# Altium schematic sheet HDMI.SchDoc
size A4; SheetNumber: 1; SheetTotal: 4
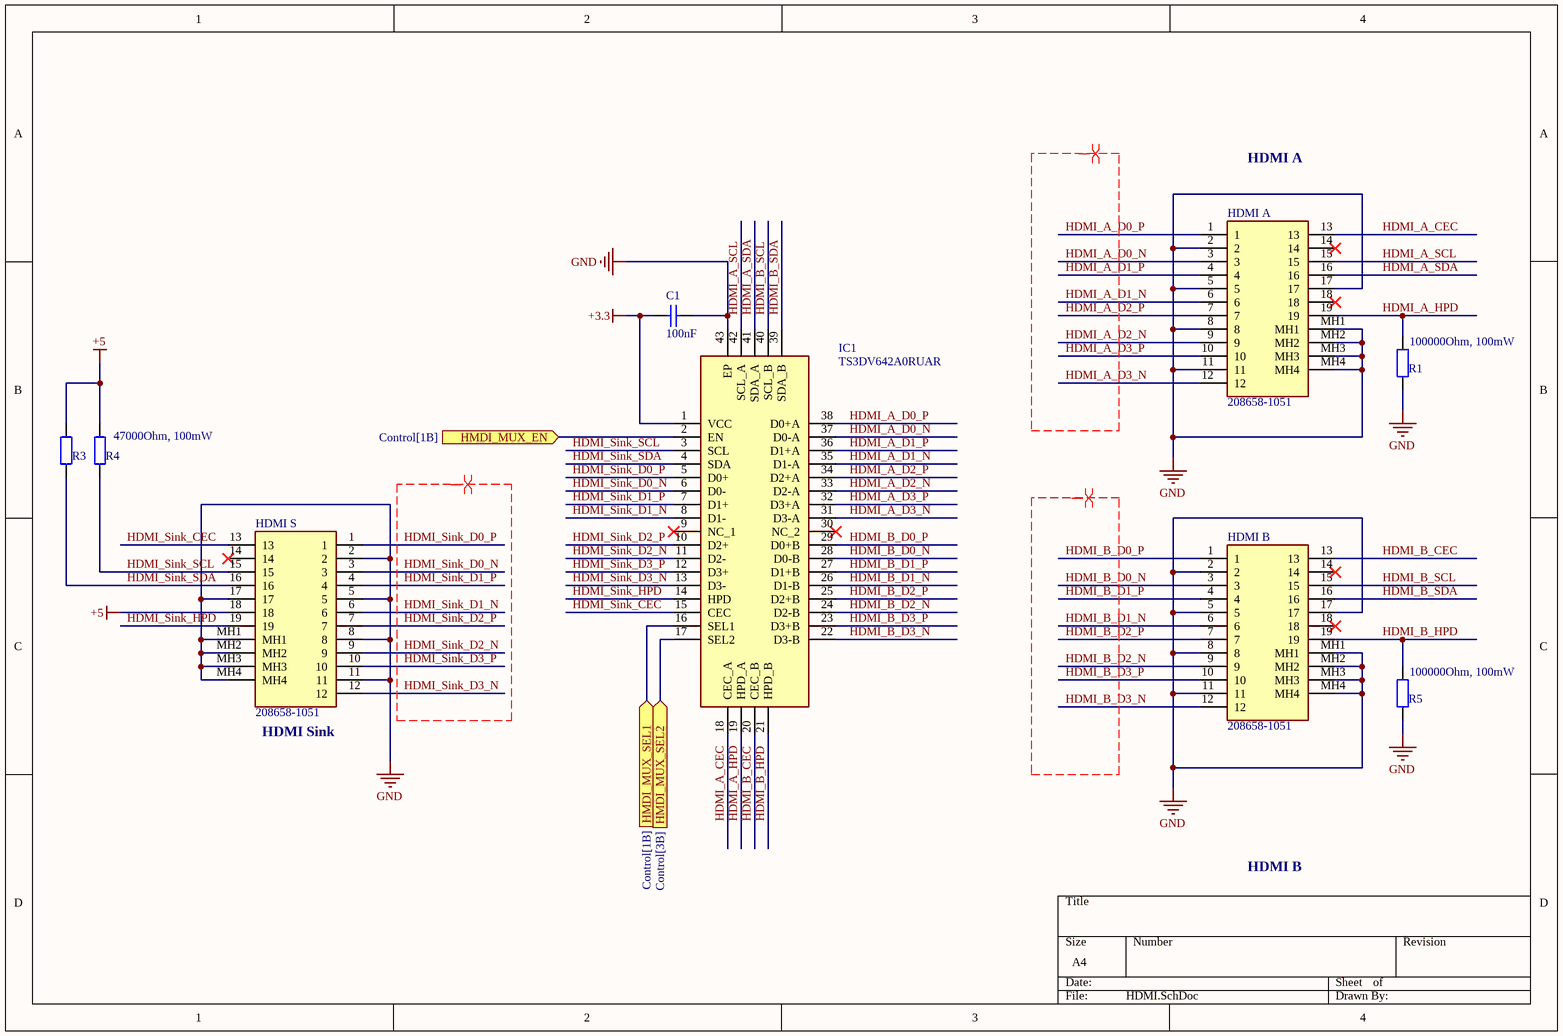
[diagram p0: HDMI.SchDoc]

## Parts
C1  Capacitance: 100nF  [WCAP-CSGP_0402_L1W0.5H0.5]  (hidden comment: 885012205037)
HDMI_A  208658-1051  [2086581051]
HDMI_B  208658-1051  [2086581051]
HDMI_S  208658-1051  [2086581051]
IC1  TS3DV642A0RUAR  [QFN50P350X900X80-43N-D]
R1  100000Ohm, 100mW  [WRIS-RSKS_0402]
R3  47000Ohm, 100mW  [WRIS-RSKS_0402]  (value not drawn)
R4  47000Ohm, 100mW  [WRIS-RSKS_0402]
R5  100000Ohm, 100mW  [WRIS-RSKS_0402]

## Ports
HMDI_MUX_EN (in, see Control[1B]), HMDI_MUX_SEL1 (in, see Control[1B]), HMDI_MUX_SEL2 (in, see Control[3B])

## Nets
+3.3: C1.1 IC1.1(VCC)
+5: HDMI_S.18 R3.2 R4.2
GND: C1.2 HDMI_A.2 HDMI_A.5 HDMI_A.8 HDMI_A.11 HDMI_A.17 HDMI_A.MH1 HDMI_A.MH2 HDMI_A.MH3 HDMI_A.MH4 HDMI_B.2 HDMI_B.5 HDMI_B.8 HDMI_B.11 HDMI_B.17 HDMI_B.MH1 HDMI_B.MH2 HDMI_B.MH3 HDMI_B.MH4 HDMI_S.2 HDMI_S.5 HDMI_S.8 HDMI_S.11 HDMI_S.17 HDMI_S.MH1 HDMI_S.MH2 HDMI_S.MH3 HDMI_S.MH4 IC1.43(EP) R1.1 R5.1
HDMI_A_CEC: HDMI_A.13 IC1.18(CEC_A)
HDMI_A_D0_N: HDMI_A.3 IC1.37(D0-A)
HDMI_A_D0_P: HDMI_A.1 IC1.38(D0+A)
HDMI_A_D1_N: HDMI_A.6 IC1.35(D1-A)
HDMI_A_D1_P: HDMI_A.4 IC1.36(D1+A)
HDMI_A_D2_N: HDMI_A.9 IC1.33(D2-A)
HDMI_A_D2_P: HDMI_A.7 IC1.34(D2+A)
HDMI_A_D3_N: HDMI_A.12 IC1.31(D3-A)
HDMI_A_D3_P: HDMI_A.10 IC1.32(D3+A)
HDMI_A_HPD: HDMI_A.19 IC1.19(HPD_A) R1.2
HDMI_A_SCL: HDMI_A.15 IC1.42(SCL_A)
HDMI_A_SDA: HDMI_A.16 IC1.41(SDA_A)
HDMI_B_CEC: HDMI_B.13 IC1.20(CEC_B)
HDMI_B_D0_N: HDMI_B.3 IC1.28(D0-B)
HDMI_B_D0_P: HDMI_B.1 IC1.29(D0+B)
HDMI_B_D1_N: HDMI_B.6 IC1.26(D1-B)
HDMI_B_D1_P: HDMI_B.4 IC1.27(D1+B)
HDMI_B_D2_N: HDMI_B.9 IC1.24(D2-B)
HDMI_B_D2_P: HDMI_B.7 IC1.25(D2+B)
HDMI_B_D3_N: HDMI_B.12 IC1.22(D3-B)
HDMI_B_D3_P: HDMI_B.10 IC1.23(D3+B)
HDMI_B_HPD: HDMI_B.19 IC1.21(HPD_B) R5.2
HDMI_B_SCL: HDMI_B.15 IC1.40(SCL_B)
HDMI_B_SDA: HDMI_B.16 IC1.39(SDA_B)
HDMI_Sink_CEC: HDMI_S.13 IC1.15(CEC)
HDMI_Sink_D0_N: HDMI_S.3 IC1.6(D0-)
HDMI_Sink_D0_P: HDMI_S.1 IC1.5(D0+)
HDMI_Sink_D1_N: HDMI_S.6 IC1.8(D1-)
HDMI_Sink_D1_P: HDMI_S.4 IC1.7(D1+)
HDMI_Sink_D2_N: HDMI_S.9 IC1.11(D2-)
HDMI_Sink_D2_P: HDMI_S.7 IC1.10(D2+)
HDMI_Sink_D3_N: HDMI_S.12 IC1.13(D3-)
HDMI_Sink_D3_P: HDMI_S.10 IC1.12(D3+)
HDMI_Sink_HPD: HDMI_S.19 IC1.14(HPD)
HDMI_Sink_SCL: HDMI_S.15 IC1.3(SCL) R4.1
HDMI_Sink_SDA: HDMI_S.16 IC1.4(SDA) R3.1
HMDI_MUX_EN: IC1.2(EN) ; port HMDI_MUX_EN
HMDI_MUX_SEL1: IC1.16(SEL1) ; port HMDI_MUX_SEL1
HMDI_MUX_SEL2: IC1.17(SEL2) ; port HMDI_MUX_SEL2

Not connected (* = marked no-connect by the designer): HDMI_A 14* 18*; HDMI_B 14* 18*; HDMI_S 14*; IC1 9(NC_1)* 30(NC_2)*

## Layout directives
differential pair; differential pair class Z100: HDMI_A_D0_N, HDMI_A_D0_P, HDMI_A_D1_N, HDMI_A_D1_P, HDMI_A_D2_N, HDMI_A_D2_P, HDMI_A_D3_N, HDMI_A_D3_P, HDMI_B_D0_N, HDMI_B_D0_P, HDMI_B_D1_N, HDMI_B_D1_P, HDMI_B_D2_N, HDMI_B_D2_P, HDMI_B_D3_N, HDMI_B_D3_P, HDMI_Sink_D0_N, HDMI_Sink_D0_P, HDMI_Sink_D1_N, HDMI_Sink_D1_P, HDMI_Sink_D2_N, HDMI_Sink_D2_P, HDMI_Sink_D3_N, HDMI_Sink_D3_P

## Notes on the sheet
- HDMI A
- (near HDMI_S) HDMI Sink
- HDMI B

## Library data of the parts
C1 = CMP-207839-000001-2: CAP CER 0.1UF 16V X7R 0402; NexarPartId: 53703175; Material: Ceramic; Tolerance: 10%; Insulation Resistance: 5GΩ; Dielectric: X7R; Case/Package: 0402; Voltage Rating (DC): 16V; Max Operating Temperature: 125°C; Width: 500µm; Packaging: Tape & Reel (TR); Height: 500µm; Min Operating Temperature: -55°C; REACH SVHC: Unknown; RoHS: Compliant; Thickness: 558.8µm; Mount: Surface Mount; Voltage Rating: 16V; Case Code (Imperial): 0402; Length: 1mm; Case Code (Metric): 1005
HDMI_A HDMI_B HDMI_S = 208658-1051: Connector; Manufacturer_Name: Molex; Height: 6.44mm; Manufacturer_Part_Number: 208658-1051; Mouser Part Number: 538-208658-1051; Mouser Price/Stock: https://www.mouser.co.uk/ProductDetail/Molex/208658-1051?qs=BJlw7L4Cy7%252Bu27sIkZU3Xw%3D%3D; Arrow Part Number: 208658-1051; Arrow Price/Stock: https://www.arrow.com/en/products/2086581051/molex?region=nac
IC1 = TS3DV642A0RUAR: Integrated Circuit; Manufacturer_Name: Texas Instruments; Datasheet Link: http://www.ti.com/lit/gpn/ts3dv642; Height: 0.8mm; Manufacturer_Part_Number: TS3DV642A0RUAR; Mouser Part Number: 595-TS3DV642A0RUAR; Mouser Price/Stock: https://www.mouser.co.uk/ProductDetail/Texas-Instruments/TS3DV642A0RUAR?qs=zjX5mX%252BjEMCTQjtLUY3z%2FA%3D%3D; Arrow Part Number: TS3DV642A0RUAR; Arrow Price/Stock: https://www.arrow.com/en/products/ts3dv642a0ruar/texas-instruments?region=nac
R1 R5 = 560112110019: WRIS-RSKS Thick Film Resistor, size 0402, 100000Ohm, 100mW; Manufacturer: Wurth Elektronik; Case/Size Code: 0402; Limiting Element Voltage: 50V; Resistance Tolerance: +/-1%; Temperature Coefficient of Resistance Min: -100ppm/°C; Temperature Coefficient of Resistance Max: 100ppm/°C; Manufacturer Part Number: 560112110019; Category: Thick Film Resistors; Match Code: WRIS-RSKS; ComponentLink1Description: Website Link; ComponentLink1URL: https://www.we-online.com/redexpert/article/560112110019?ad; ComponentLink2Description: Datasheet Link; ComponentLink2URL: https://www.we-online.com/redexpert/spec/560112110019?ad; Mount: Surface Mount; Operating Temperature Max: 155°C; Operating Temperature Min: -55°C; Packaging: Tape and Reel; Length: 1mm; Width: 0.5mm; Height: 0.35mm; Rated Power: 100mW; Resistance: 100000Ohm
R3 R4 = 560112110055: WRIS-RSKS Thick Film Resistor, size 0402, 47000Ohm, 100mW; Manufacturer: Wurth Elektronik; Case/Size Code: 0402; Limiting Element Voltage: 50V; Resistance Tolerance: +/-1%; Temperature Coefficient of Resistance Min: -100ppm/°C; Temperature Coefficient of Resistance Max: 100ppm/°C; Manufacturer Part Number: 560112110055; Category: Thick Film Resistors; Match Code: WRIS-RSKS; ComponentLink1Description: Website Link; ComponentLink1URL: https://www.we-online.com/redexpert/article/560112110055?ad; ComponentLink2Description: Datasheet Link; ComponentLink2URL: https://www.we-online.com/redexpert/spec/560112110055?ad; Mount: Surface Mount; Operating Temperature Max: 155°C; Operating Temperature Min: -55°C; Packaging: Tape and Reel; Length: 1mm; Width: 0.5mm; Height: 0.35mm; Rated Power: 100mW; Resistance: 47000Ohm